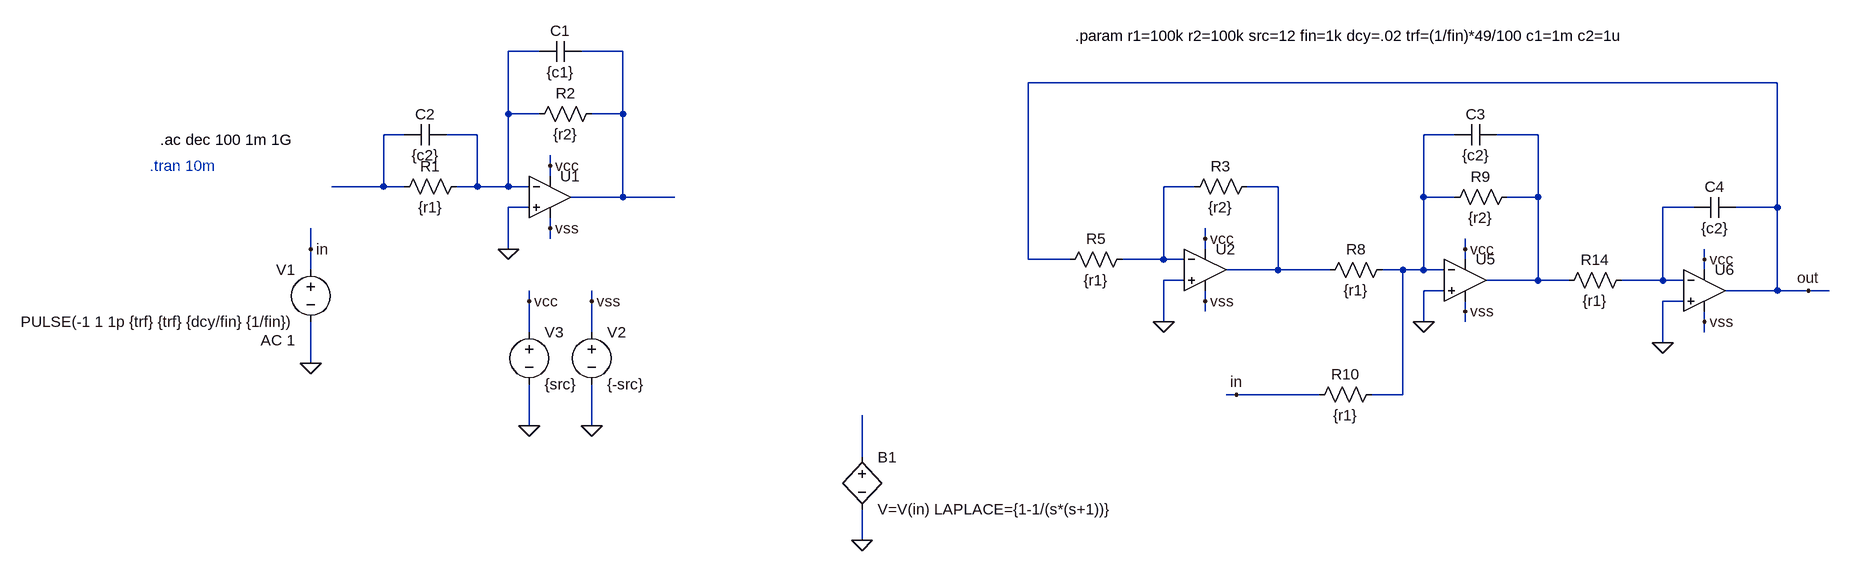
[diagram p0: schematic filt.asc]
filt.asc, the LTspice schematic file:
Version 4
SHEET 1 3188 1296
WIRE 160 -80 112 -80
WIRE 288 -80 224 -80
WIRE 2064 -32 912 -32
WIRE 112 16 112 -80
WIRE 160 16 112 16
WIRE 288 16 288 -80
WIRE 288 16 240 16
WIRE -48 48 -80 48
WIRE 64 48 16 48
WIRE 1568 48 1520 48
WIRE 1696 48 1632 48
WIRE 176 96 176 80
WIRE 176 112 176 96
WIRE -80 128 -80 48
WIRE -80 128 -160 128
WIRE -48 128 -80 128
WIRE 64 128 64 48
WIRE 64 128 32 128
WIRE 112 128 112 16
WIRE 112 128 64 128
WIRE 144 128 112 128
WIRE 1168 128 1120 128
WIRE 1296 128 1248 128
WIRE 288 144 288 16
WIRE 288 144 208 144
WIRE 368 144 288 144
WIRE 1520 144 1520 48
WIRE 1568 144 1520 144
WIRE 1696 144 1696 48
WIRE 1696 144 1648 144
WIRE 144 160 112 160
WIRE 1936 160 1888 160
WIRE 2064 160 2064 -32
WIRE 2064 160 2000 160
WIRE 176 192 176 176
WIRE 176 208 176 192
WIRE 1184 208 1184 192
WIRE -192 224 -192 192
WIRE 112 224 112 160
WIRE 1184 224 1184 208
WIRE 1584 224 1584 208
WIRE 912 240 912 -32
WIRE 976 240 912 240
WIRE 1120 240 1120 128
WIRE 1120 240 1056 240
WIRE 1152 240 1120 240
WIRE 1584 240 1584 224
WIRE 1952 240 1952 224
WIRE -192 256 -192 224
WIRE 1296 256 1296 128
WIRE 1296 256 1216 256
WIRE 1376 256 1296 256
WIRE 1488 256 1456 256
WIRE 1520 256 1520 144
WIRE 1520 256 1488 256
WIRE 1552 256 1520 256
WIRE 1952 256 1952 240
WIRE 1152 272 1120 272
WIRE 1696 272 1696 144
WIRE 1696 272 1616 272
WIRE 1744 272 1696 272
WIRE 1888 272 1888 160
WIRE 1888 272 1824 272
WIRE 1920 272 1888 272
WIRE 1552 288 1520 288
WIRE 2064 288 2064 160
WIRE 2064 288 1984 288
WIRE 2112 288 2064 288
WIRE 2144 288 2112 288
WIRE 144 304 144 288
WIRE 240 304 240 288
WIRE 1184 304 1184 288
WIRE 1920 304 1888 304
WIRE 1184 320 1184 304
WIRE 1584 320 1584 304
WIRE 1120 336 1120 272
WIRE 1520 336 1520 288
WIRE 1584 336 1584 320
WIRE 1952 336 1952 320
WIRE 144 352 144 304
WIRE 240 352 240 304
WIRE 1952 352 1952 336
WIRE 1888 368 1888 304
WIRE -192 400 -192 336
WIRE 1232 448 1216 448
WIRE 1360 448 1232 448
WIRE 1488 448 1488 256
WIRE 1488 448 1440 448
WIRE 144 496 144 432
WIRE 240 496 240 432
WIRE 656 544 656 480
WIRE 656 672 656 624
FLAG 176 96 vcc
FLAG 176 192 vss
FLAG -192 400 0
FLAG 240 496 0
FLAG 144 496 0
FLAG 144 304 vcc
FLAG 240 304 vss
FLAG 112 224 0
FLAG -192 224 in
FLAG 656 672 0
FLAG 1584 224 vcc
FLAG 1584 320 vss
FLAG 1232 448 in
FLAG 1184 208 vcc
FLAG 1184 304 vss
FLAG 1120 336 0
FLAG 1952 240 vcc
FLAG 1952 336 vss
FLAG 1888 368 0
FLAG 2112 288 out
FLAG 1520 336 0
SYMBOL OpAmps\\UniversalOpamp 176 144 R0
SYMATTR InstName U1
SYMBOL res 48 112 R90
WINDOW 0 0 56 VBottom 2
WINDOW 3 32 56 VTop 2
SYMATTR InstName R1
SYMATTR Value {r1}
SYMBOL res 256 0 R90
WINDOW 0 0 56 VBottom 2
WINDOW 3 32 56 VTop 2
SYMATTR InstName R2
SYMATTR Value {r2}
SYMBOL voltage -192 240 M0
WINDOW 123 24 124 Left 2
WINDOW 39 0 0 Left 0
SYMATTR Value2 AC 1
SYMATTR InstName V1
SYMATTR Value PULSE(-1 1 1p {trf} {trf} {dcy/fin} {1/fin})
SYMBOL voltage 240 336 R0
WINDOW 123 0 0 Left 0
WINDOW 39 0 0 Left 0
SYMATTR InstName V2
SYMATTR Value {-src}
SYMBOL voltage 144 336 R0
WINDOW 123 0 0 Left 0
WINDOW 39 0 0 Left 0
SYMATTR InstName V3
SYMATTR Value {src}
SYMBOL cap 224 -96 R90
WINDOW 0 0 32 VBottom 2
WINDOW 3 32 32 VTop 2
SYMATTR InstName C1
SYMATTR Value {c1}
SYMBOL cap 16 32 R90
WINDOW 0 0 32 VBottom 2
WINDOW 3 32 32 VTop 2
SYMATTR InstName C2
SYMATTR Value {c2}
SYMBOL bv 656 528 R0
SYMATTR InstName B1
SYMATTR Value V=V(in) LAPLACE={1-1/(s*(s+1))}
SYMBOL cap 1632 32 R90
WINDOW 0 0 32 VBottom 2
WINDOW 3 32 32 VTop 2
SYMATTR InstName C3
SYMATTR Value {c2}
SYMBOL OpAmps\\UniversalOpamp 1584 272 R0
SYMATTR InstName U5
SYMBOL res 1472 240 R90
WINDOW 0 0 56 VBottom 2
WINDOW 3 32 56 VTop 2
SYMATTR InstName R8
SYMATTR Value {r1}
SYMBOL res 1664 128 R90
WINDOW 0 0 56 VBottom 2
WINDOW 3 32 56 VTop 2
SYMATTR InstName R9
SYMATTR Value {r2}
SYMBOL res 1344 464 R270
WINDOW 0 32 56 VTop 2
WINDOW 3 0 56 VBottom 2
SYMATTR InstName R10
SYMATTR Value {r1}
SYMBOL OpAmps\\UniversalOpamp 1184 256 R0
SYMATTR InstName U2
SYMBOL res 1264 112 R90
WINDOW 0 0 56 VBottom 2
WINDOW 3 32 56 VTop 2
SYMATTR InstName R3
SYMATTR Value {r2}
SYMBOL res 1072 224 R90
WINDOW 0 0 56 VBottom 2
WINDOW 3 32 56 VTop 2
SYMATTR InstName R5
SYMATTR Value {r1}
SYMBOL OpAmps\\UniversalOpamp 1952 288 R0
SYMATTR InstName U6
SYMBOL res 1840 256 R90
WINDOW 0 0 56 VBottom 2
WINDOW 3 32 56 VTop 2
SYMATTR InstName R14
SYMATTR Value {r1}
SYMBOL cap 2000 144 R90
WINDOW 0 0 32 VBottom 2
WINDOW 3 32 32 VTop 2
SYMATTR InstName C4
SYMATTR Value {c2}
TEXT -424 56 Left 2 !.ac dec 100 1m 1G
TEXT 984 -104 Left 2 !.param r1=100k r2=100k src=12 fin=1k dcy=.02 trf=(1/fin)*49/100 c1=1m c2=1u
TEXT -440 96 Left 2 ;.tran 10m

The netlist it stands for:
* filt.asc
XU1 0 N001 vcc vss N002 level1 Avol=1Meg GBW=10Meg Vos=0 En=0 Enk=0 In=0 Ink=0 Rin=500Meg  ; pins In+ In- V+ V- OUT
R1 N001 N003 {r1}
R2 N002 N001 {r2}
V1 in 0 PULSE(-1 1 1p {trf} {trf} {dcy/fin} {1/fin}) AC 1
V2 vss 0 {-src}
V3 vcc 0 {src}
C1 N002 N001 {c1}
C2 N001 N003 {c2}
B1 N009 0 V=V(in) LAPLACE={1-1/(s*(s+1))}
C3 N005 N004 {c2}
XU5 0 N004 vcc vss N005 level1 Avol=1Meg GBW=10Meg Vos=0 En=0 Enk=0 In=0 Ink=0 Rin=500Meg  ; pins In+ In- V+ V- OUT
R8 N004 N007 {r1}
R9 N005 N004 {r2}
R10 in N004 {r1}
XU2 0 N006 vcc vss N007 level1 Avol=1Meg GBW=10Meg Vos=0 En=0 Enk=0 In=0 Ink=0 Rin=500Meg  ; pins In+ In- V+ V- OUT
R3 N007 N006 {r2}
R5 N006 out {r1}
XU6 0 N008 vcc vss out level1 Avol=1Meg GBW=10Meg Vos=0 En=0 Enk=0 In=0 Ink=0 Rin=500Meg  ; pins In+ In- V+ V- OUT
R14 N008 N005 {r1}
C4 out N008 {c2}
.ac dec 100 1m 1G
.param r1=100k r2=100k src=12 fin=1k dcy=.02 trf=(1/fin)*49/100 c1=1m c2=1u
* .tran 10m
.lib UniversalOpAmp1.lib
.backanno
.end